# EAGLE design PCB-Neopixel Developer (EAGLE 9.5.2)
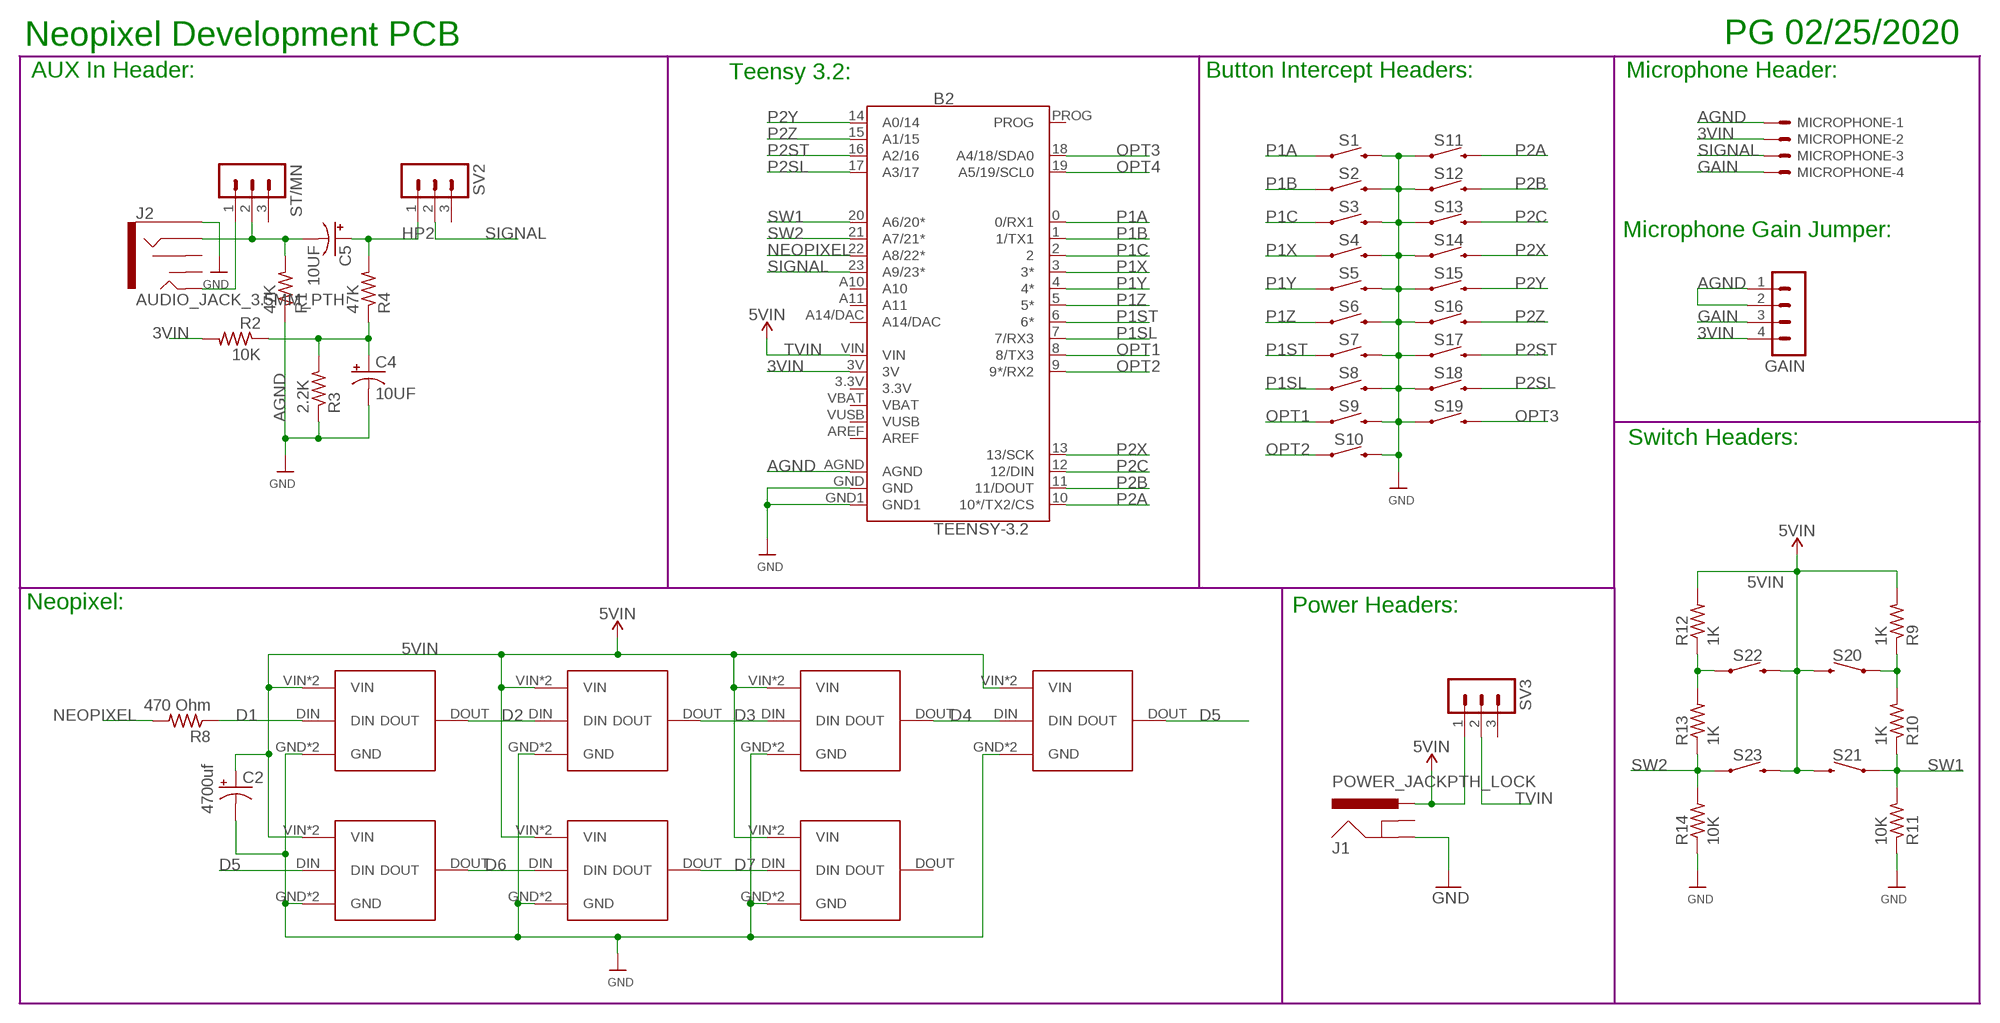
[diagram p0: schematic, sheet 1]

## Parts
B2  TEENSY-3.2  TEENSY-3.1SILK  [TEENSY-3.1]
C2  4700uf  CPOL-USE5-13  [E5-13]
C4  10UF  CPOL-USE5-8.5  [E5-8,5]
C5  10UF  CPOL-USE5-8.5  [E5-8,5]
GAIN  MA04-1  [MA04-1]
J1  POWER_JACKPTH_LOCK  [POWER_JACK_PTH_LOCK]
J2  AUDIO_JACK_3.5MM_PTH  [AUDIO-JACK]
MICROPHONE  KK-156-4  [KK-156-4]
R1  47K  R-US_R1206  [R1206]
R2  10K  R-US_R1206  [R1206]
R3  2.2K  R-US_R1206  [R1206]
R4  47K  R-US_R1206  [R1206]
R8  470 Ohm  R-US_R1206  [R1206]
R9  1K  R-US_R1206  [R1206]
R10  1K  R-US_R1206  [R1206]
R11  10K  R-US_R1206  [R1206]
R12  1K  R-US_R1206  [R1206]
R13  1K  R-US_R1206  [R1206]
R14  10K  R-US_R1206  [R1206]
S1  MOMENTARY-SWITCH-SPST-SMD-6.2MM-TALL  [TACTILE_SWITCH_SMD_6.2MM_TALL]
S2  MOMENTARY-SWITCH-SPST-SMD-6.2MM-TALL  [TACTILE_SWITCH_SMD_6.2MM_TALL]
S3  MOMENTARY-SWITCH-SPST-SMD-6.2MM-TALL  [TACTILE_SWITCH_SMD_6.2MM_TALL]
S4  MOMENTARY-SWITCH-SPST-SMD-6.2MM-TALL  [TACTILE_SWITCH_SMD_6.2MM_TALL]
S5  MOMENTARY-SWITCH-SPST-SMD-6.2MM-TALL  [TACTILE_SWITCH_SMD_6.2MM_TALL]
S6  MOMENTARY-SWITCH-SPST-SMD-6.2MM-TALL  [TACTILE_SWITCH_SMD_6.2MM_TALL]
S7  MOMENTARY-SWITCH-SPST-SMD-6.2MM-TALL  [TACTILE_SWITCH_SMD_6.2MM_TALL]
S8  MOMENTARY-SWITCH-SPST-SMD-6.2MM-TALL  [TACTILE_SWITCH_SMD_6.2MM_TALL]
S9  MOMENTARY-SWITCH-SPST-SMD-6.2MM-TALL  [TACTILE_SWITCH_SMD_6.2MM_TALL]
S10  MOMENTARY-SWITCH-SPST-SMD-6.2MM-TALL  [TACTILE_SWITCH_SMD_6.2MM_TALL]
S11  MOMENTARY-SWITCH-SPST-SMD-6.2MM-TALL  [TACTILE_SWITCH_SMD_6.2MM_TALL]
S12  MOMENTARY-SWITCH-SPST-SMD-6.2MM-TALL  [TACTILE_SWITCH_SMD_6.2MM_TALL]
S13  MOMENTARY-SWITCH-SPST-SMD-6.2MM-TALL  [TACTILE_SWITCH_SMD_6.2MM_TALL]
S14  MOMENTARY-SWITCH-SPST-SMD-6.2MM-TALL  [TACTILE_SWITCH_SMD_6.2MM_TALL]
S15  MOMENTARY-SWITCH-SPST-SMD-6.2MM-TALL  [TACTILE_SWITCH_SMD_6.2MM_TALL]
S16  MOMENTARY-SWITCH-SPST-SMD-6.2MM-TALL  [TACTILE_SWITCH_SMD_6.2MM_TALL]
S17  MOMENTARY-SWITCH-SPST-SMD-6.2MM-TALL  [TACTILE_SWITCH_SMD_6.2MM_TALL]
S18  MOMENTARY-SWITCH-SPST-SMD-6.2MM-TALL  [TACTILE_SWITCH_SMD_6.2MM_TALL]
S19  MOMENTARY-SWITCH-SPST-SMD-6.2MM-TALL  [TACTILE_SWITCH_SMD_6.2MM_TALL]
S20  MOMENTARY-SWITCH-SPST-PTH-6.0MM  [TACTILE_SWITCH_PTH_6.0MM]
S21  MOMENTARY-SWITCH-SPST-PTH-6.0MM  [TACTILE_SWITCH_PTH_6.0MM]
S22  MOMENTARY-SWITCH-SPST-PTH-6.0MM  [TACTILE_SWITCH_PTH_6.0MM]
S23  MOMENTARY-SWITCH-SPST-PTH-6.0MM  [TACTILE_SWITCH_PTH_6.0MM]
ST/MN  MA03-1  [MA03-1]
SV2  MA03-1  [MA03-1]
SV3  MA03-1  [MA03-1]
U$2  NP-2  [NP-2]
U$7  NP-2  [NP-2]
U$8  NP-3  [NP-3]
U$10  NP-3  [NP-3]
U$11  NP-3  [NP-3]
U$12  NP-3  [NP-3]
U$13  NP-3  [NP-3]

## Nets
3VIN: B2.3V GAIN.4 MICROPHONE.2 R2.2
5VIN: C2.+ J1.PWR R9.2 R12.2 S20.3 S21.3 S22.3 S23.3 SV3.1 U$2.VIN U$2.VOUT(VIN) U$7.VIN U$7.VOUT(VIN) U$8.VIN U$8.VOUT(VIN) U$10.VIN U$10.VOUT(VIN) U$11.VIN U$11.VOUT(VIN) U$12.VIN U$12.VOUT(VIN) U$13.VIN U$13.VOUT(VIN)
AGND: B2.AGND C4.- GAIN.1 GAIN.2 J2.SLEEVE MICROPHONE.1 R1.1 R3.1 ; supply symbol labelled GND
D1: R8.1 U$12.DIN
D2: U$12.DOUT U$13.DIN
D3: U$2.DIN U$13.DOUT
D4: U$2.DOUT U$11.DIN
D5: U$7.DIN U$11.DOUT
D6: U$7.DOUT U$8.DIN
D7: U$8.DOUT U$10.DIN
GAIN: GAIN.3 MICROPHONE.4
GND: B2.GND B2.GND1 C2.- J1.GND R11.1 R14.1 S1.B2 S2.B2 S3.B2 S4.B2 S5.B2 S6.B2 S7.B2 S8.B2 S9.B2 S10.B2 S11.A2 S12.A2 S13.A2 S14.A2 S15.A2 S16.A2 S17.A2 S18.A2 S19.A2 U$2.GND U$2.GND1(GND) U$7.GND U$7.GND1(GND) U$8.GND U$8.GND1(GND) U$10.GND U$10.GND1(GND) U$11.GND U$11.GND1(GND) U$12.GND U$12.GND1(GND) U$13.GND U$13.GND1(GND)
HP1: C4.+ R2.1 R3.2 R4.1
HP2: C5.+ R4.2 SV2.1
N$2: J2.TIP ST/MN.1
N$4: C5.- J2.RING R1.2 ST/MN.2
NEOPIXEL: B2.22(A8/22*) R8.2
OPT1: B2.8(8/TX3) S9.A2
OPT2: B2.9(9*/RX2) S10.A2
OPT3: B2.18(A4/18/SDA0) S19.B2
OPT4: B2.19(A5/19/SCL0)
P1A: B2.0(0/RX1) S1.A2
P1B: B2.1(1/TX1) S2.A2
P1C: B2.2 S3.A2
P1SL: B2.7(7/RX3) S8.A2
P1ST: B2.6(6*) S7.A2
P1X: B2.3(3*) S4.A2
P1Y: B2.4(4*) S5.A2
P1Z: B2.5(5*) S6.A2
P2A: B2.10(10*/TX2/CS) S11.B2
P2B: B2.11(11/DOUT) S12.B2
P2C: B2.12(12/DIN) S13.B2
P2SL: B2.17(A3/17) S18.B2
P2ST: B2.16(A2/16) S17.B2
P2X: B2.13(13/SCK) S14.B2
P2Y: B2.14(A0/14) S15.B2
P2Z: B2.15(A1/15) S16.B2
SIGNAL: B2.23(A9/23*) MICROPHONE.3 SV2.2
SW1: B2.20(A6/20*) R10.1 R11.2 S21.1
SW1A: R9.1 R10.2 S20.1
SW2: B2.21(A7/21*) R13.1 R14.2 S23.1
SW2A: R12.1 R13.2 S22.1
TVIN: B2.VIN SV3.2 ; supply symbol labelled 5VIN
Unconnected: B2.A10 B2.A11 B2.A14/DAC B2.AREF B2.PROG J1.GNDBREAK J2.RSH J2.TSH ST/MN.3 SV2.3 SV3.3 U$10.DOUT

## Notes on the sheet
- Neopixel Development PCB | PG 02/25/2020
- AUX In Header: | Teensy 3.2: | Button Intercept Headers: | Microphone Header:
- Microphone Gain Jumper:
- Switch Headers:
- Neopixel: | Power Headers:

## Power pins joined to a net without a drawn wire
3.3V: B2.3.3V
VBAT: B2.VBAT
VUSB: B2.VUSB

## Library data of the parts
B2 = SparkFun-Boards:TEENSY-3.1: Teensy 3+ Footprint Mechanical footprint with connectors for Teensy Development Board with ARM Cortex. SparkFun Products: Teensy 3.2 <https://www.sparkfun.com/products/13736> Teensy LC <https://www.sparkfun.com/products/13305>; SF_ID: DEV-12646
C2 C4 C5 = adafruit:CPOL-US: POLARIZED CAPACITOR, American symbol
GAIN = con-lstb:MA04-1: PIN HEADER; OC_FARNELL: unknown; OC_NEWARK: unknown
J1 = SparkFun-Connectors:POWER_JACK: Power Jack Connector This is the standard 5.5mm barrel jack for power. The PTH is the most common, proven, reliable, footprint. The Slot footprint only works if the mill layer is transmitted to the PCB fab house so be warned. Here are the connectors we sell at SparkFun: DC Barrel Power Jack/Connector <https://www.sparkfun.com/products/119> (PRT-00119) DC Barrel Power Jack/Connector (SMD) <https://www.sparkfun.com/products/12748> (PRT-12748) DC Barrel Jack Adapter - Breadboard Compatible <https://www.sparkfun.com/products/10811> (PRT-10811) It is used on this SparkFun product (and many, many others): SparkFun RedBoard - Programmed with Arduino <https://www.sparkfun.com/products/12757> (DEV-12757) Also, if you need a mating power supply or connector, please check these out: Wall Adapter Power Supply - 9VDC 650mA <https://www.sparkfun.com/products/298> (TOL-00298) DC Barrel Jack Adapter - Male <https://www.sparkfun.com/products/10287> (PRT-10287); PROD_ID: CONN-08197; SF_ID: PRT-00119
J2 = SparkFun-Connectors:AUDIO_JACK_3.5MM: Audio Jack 3.5mm variants of PTH and SMT stereo audio jack with bypass switches. SparkFun Products: SparkFun SparkPunk Sound Kit <[https://www.sparkfun.com/products/11177]> - PTH MP3 Trigger <https://www.sparkfun.com/products/13720> -3.5mm SMD SparkFun PicoBoard <https://www.sparkfun.com/products/11888>- 2.5mm SMD; PROD_ID: CONN-08774; SF_ID: PRT-08032
MICROPHONE = con-molex:KK-156-4: KK 156 HEADER Source: http://www.molex.com/pdm_docs/sd/026604100_sd.pdf; MF: MOLEX; OC_FARNELL: unknown; OC_NEWARK: unknown
R1-R4 R8-R14 = adafruit:R-US_: RESISTOR, American symbol
S1-S19 = SparkFun-Switches:MOMENTARY-SWITCH-SPST: Momentary Switch (Pushbutton) - SPST Normally-open (NO) SPST momentary switches (buttons, pushbuttons). Variants PTH-12MM - 12mm square, through-hole Momentary Pushbutton Switch - 12mm Square <https://www.sparkfun.com/products/9190> (COM-09190) PTH-6.0MM, PTH-6.0MM-KIT - 6.0mm square, through-hole Mini Pushbutton Switch <https://www.sparkfun.com/products/97> (COM-00097) KIT package intended for soldering kit's - only one side of pads' copper is exposed. PTH-RIGHT-ANGLE-KIT - Right-angle, through-hole Right Angle Tactile Button <https://www.sparkfun.com/products/10791> - Used on SparkFun BigTime Watch Kit <https://www.sparkfun.com/products/11734> SMD-12MM - 12mm square, surface-mount Tactile Button - SMD (12mm) <https://www.sparkfun.com/products/12993> (COM-12993) Used on SparkFun PicoBoard <https://www.sparkfun.com/products/11888> SMD-4.5MM - 4.5mm Square Trackball Switch Used on SparkFun Blackberry Trackballer Breakout <https://www.sparkfun.com/products/13169> SMD-4.6MMX2.8MM - 4.60mm x 2.80mm, surface mount Used on SparkFun SAMD21 Mini Breakout <https://www.sparkfun.com/products/13664> SMD-5.2MM, SMD-5.2-REDUNDANT - 5.2mm square, surface-mount Mini Pushbutton Switch - SMD <https://www.sparkfun.com/products/8720> (COM-08720) Used on Arduino Pro Mini <https://www.sparkfun.com/products/11114> REDUNDANT package connects both switch circuits together SMD-6.0X3.5MM - 6.0 x 3.5mm, surface mount Momentary Reset Switch SMD <https://www.sparkfun.com/products/8229> (COM-08229) SMD-6.2MM-TALL - 6.2mm square, surface mount Tactile Button - SMD (6mm) <https://www.sparkfun.com/products/12992> Used on SparkFun Digital Sandbox <https://www.sparkfun.com/products/12651> SMD-RIGHT-ANGLE - Right-angle, surface mount Used on SparkFun Block for Intel® Edison - Arduino <https://www.sparkfun.com/products/13036>; PROD_ID: SWCH-11966; SF_SKU: COM-12992
S20-S23 = SparkFun-Switches:MOMENTARY-SWITCH-SPST: Momentary Switch (Pushbutton) - SPST Normally-open (NO) SPST momentary switches (buttons, pushbuttons). Variants PTH-12MM - 12mm square, through-hole Momentary Pushbutton Switch - 12mm Square <https://www.sparkfun.com/products/9190> (COM-09190) PTH-6.0MM, PTH-6.0MM-KIT - 6.0mm square, through-hole Mini Pushbutton Switch <https://www.sparkfun.com/products/97> (COM-00097) KIT package intended for soldering kit's - only one side of pads' copper is exposed. PTH-RIGHT-ANGLE-KIT - Right-angle, through-hole Right Angle Tactile Button <https://www.sparkfun.com/products/10791> - Used on SparkFun BigTime Watch Kit <https://www.sparkfun.com/products/11734> SMD-12MM - 12mm square, surface-mount Tactile Button - SMD (12mm) <https://www.sparkfun.com/products/12993> (COM-12993) Used on SparkFun PicoBoard <https://www.sparkfun.com/products/11888> SMD-4.5MM - 4.5mm Square Trackball Switch Used on SparkFun Blackberry Trackballer Breakout <https://www.sparkfun.com/products/13169> SMD-4.6MMX2.8MM - 4.60mm x 2.80mm, surface mount Used on SparkFun SAMD21 Mini Breakout <https://www.sparkfun.com/products/13664> SMD-5.2MM, SMD-5.2-REDUNDANT - 5.2mm square, surface-mount Mini Pushbutton Switch - SMD <https://www.sparkfun.com/products/8720> (COM-08720) Used on Arduino Pro Mini <https://www.sparkfun.com/products/11114> REDUNDANT package connects both switch circuits together SMD-6.0X3.5MM - 6.0 x 3.5mm, surface mount Momentary Reset Switch SMD <https://www.sparkfun.com/products/8229> (COM-08229) SMD-6.2MM-TALL - 6.2mm square, surface mount Tactile Button - SMD (6mm) <https://www.sparkfun.com/products/12992> Used on SparkFun Digital Sandbox <https://www.sparkfun.com/products/12651> SMD-RIGHT-ANGLE - Right-angle, surface mount Used on SparkFun Block for Intel® Edison - Arduino <https://www.sparkfun.com/products/13036>; PROD_ID: SWCH-08441; SF_SKU: COM-00097
ST/MN SV2 SV3 = con-lstb:MA03-1: PIN HEADER; OC_FARNELL: unknown; OC_NEWARK: unknown
U$2 U$7 = Neopixel:NP-2
U$8 U$10-U$13 = Neopixel:NP-3

## Board
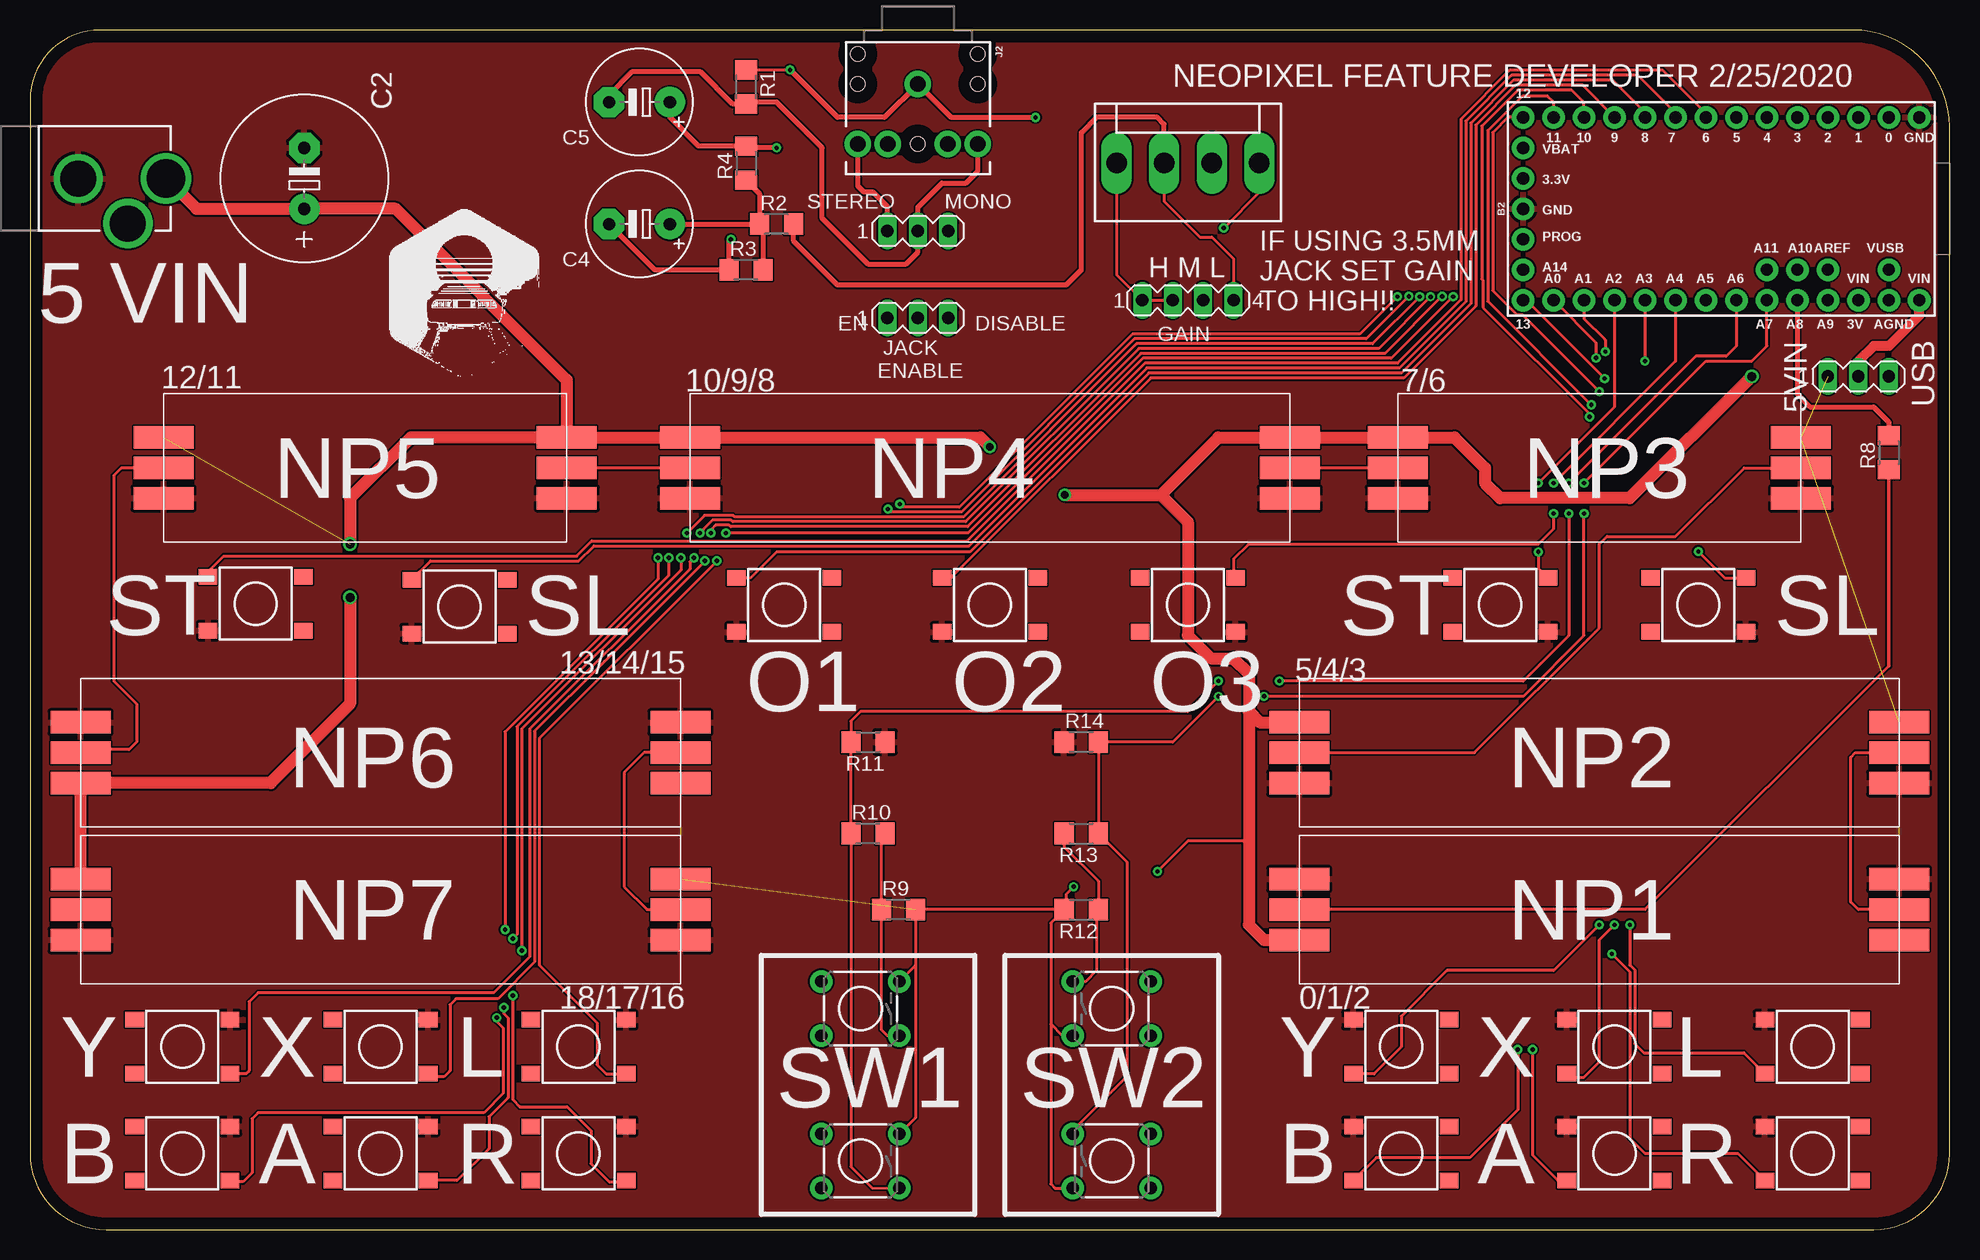
[diagram p1: board, top side]
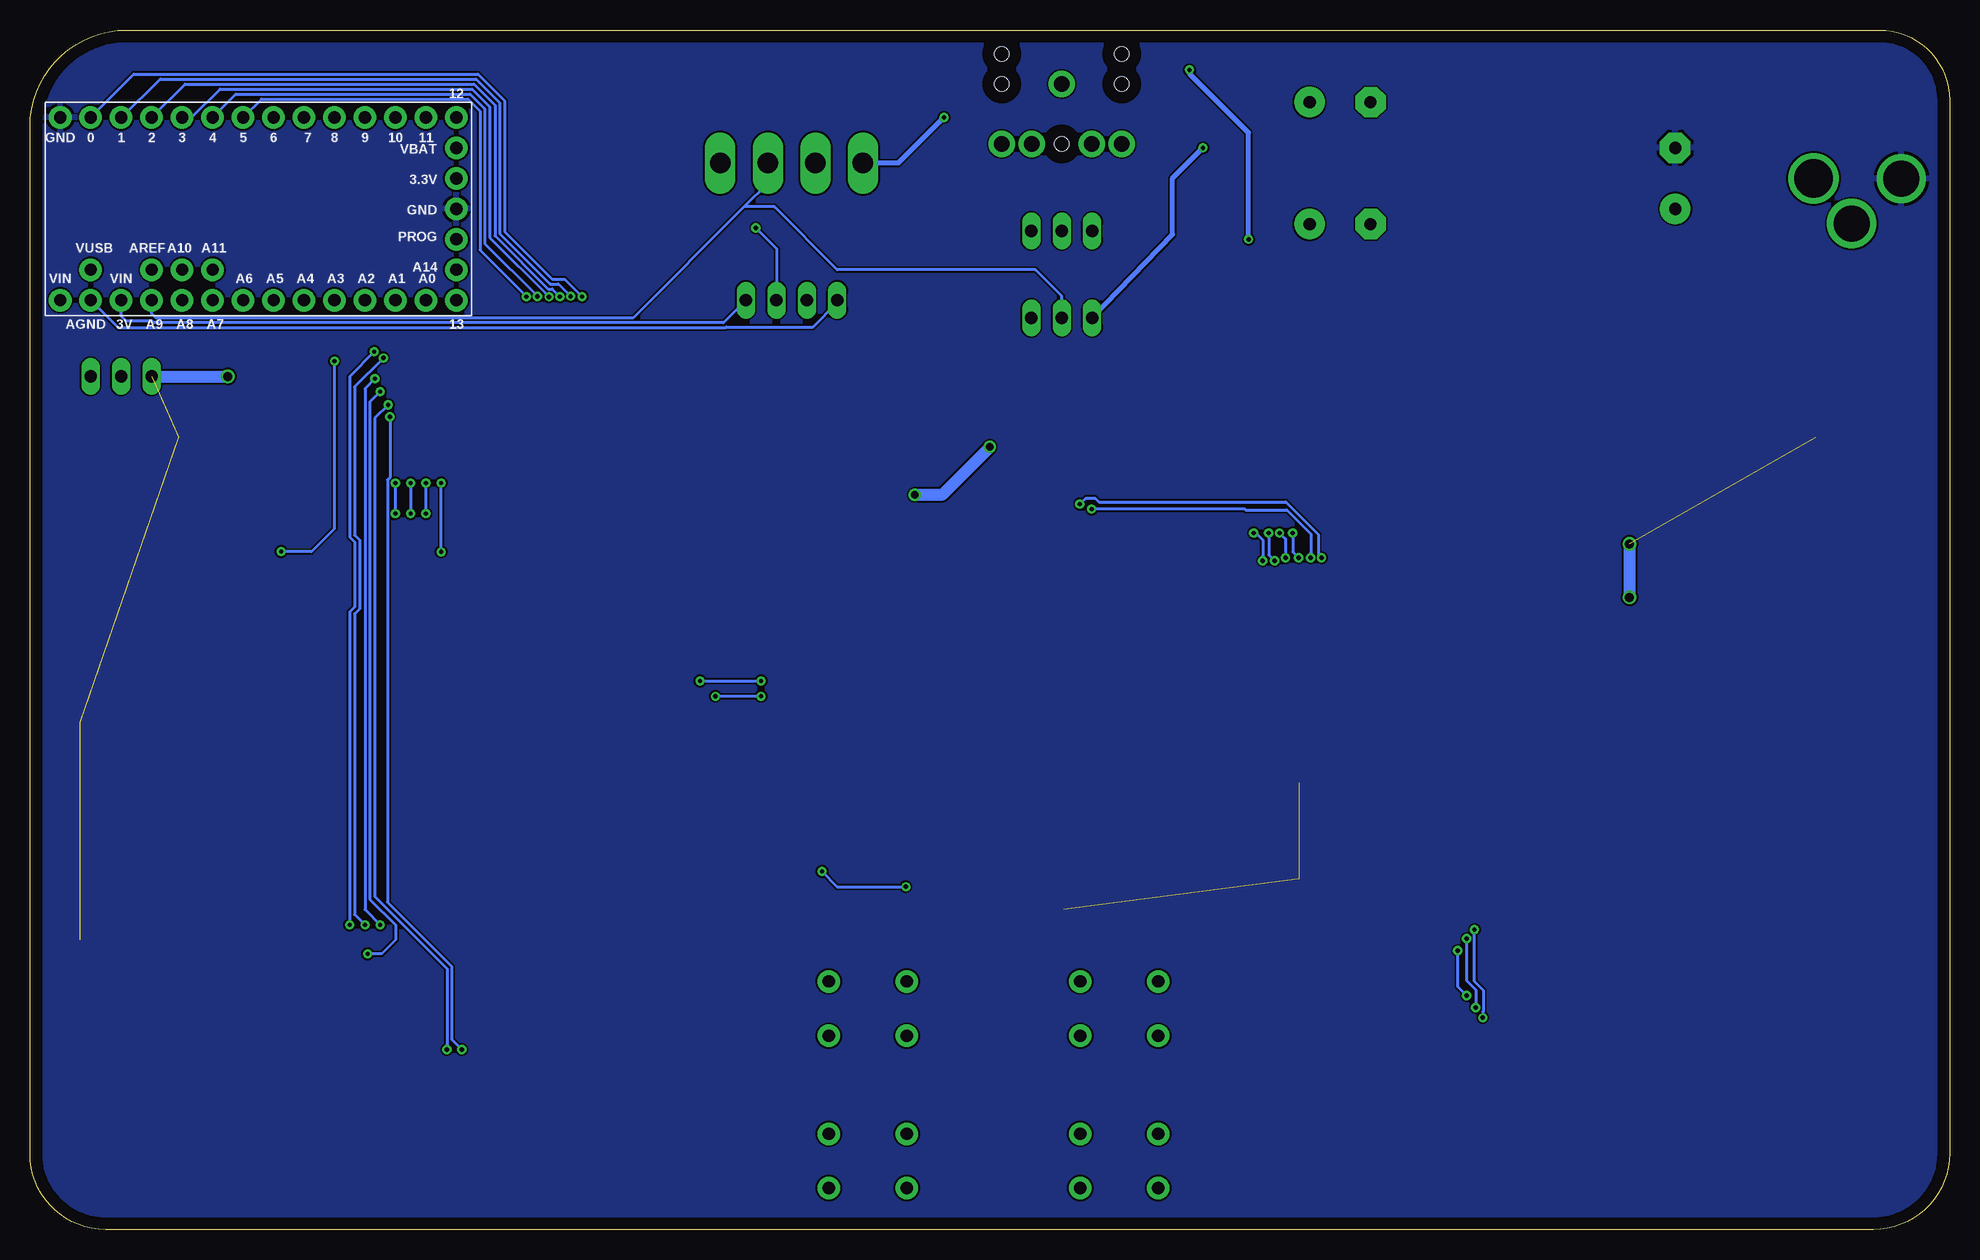
[diagram p2: board, bottom side, seen from below]

Size 160 x 100 mm. Coordinates in mm from the lower left corner, seen from the top.
Outline: 151.93,100 5.85,100 arc90 0,94.15 0,6.35 arc90 6.35,0 153.69,0 arc90 160,6.31 160,91.93 arc90 151.93,100
Copper layers (1*16): Top 0.035mm / dielectric 1.5mm / Bottom 0.035mm
Design rules "default": minimum track width 6mil, minimum drill 0.35mm, track to track 6mil, track to pad 6mil, pad to pad 6mil, via to via 6mil, smd to smd 6mil, copper to edge 40mil, drill to drill 6mil, minimum pad ring 10mil, minimum via ring 8mil, stop-mask expansion 4mil, vias tented up to drill 0.5mm, thermal gap 10mil

### Footprints (pad centres in the part's own frame; a part is rotated, then mirrored left to right if it is on the bottom)
TEENSY-3.1 = drill 1.016 pad 1.88: 0 7.62,-13.97; 1 7.62,-11.43; 2 7.62,-8.89; 3 7.62,-6.35; 3.3V 2.54,16.51; 3V -7.62,-11.43; 4 7.62,-3.81; 5 7.62,-1.27; 6 7.62,1.27; 7 7.62,3.81; 8 7.62,6.35; 9 7.62,8.89; 10 7.62,11.43; 11 7.62,13.97; 12 7.62,16.51; 13 -7.62,16.51; 14 -7.62,13.97; 15 -7.62,11.43; 16 -7.62,8.89; 17 -7.62,6.35; 18 -7.62,3.81; 19 -7.62,1.27; 20 -7.62,-1.27; 21 -7.62,-3.81; 22 -7.62,-6.35; 23 -7.62,-8.89; A10 -5.08,-6.35; A11 -5.08,-3.81; A14/DAC -5.08,16.51; AGND -7.62,-13.97; AREF -5.08,-8.89; GND 0,16.51; GND1 7.62,-16.51; PROG -2.54,16.51; VBAT 5.08,16.51; VIN -7.62,-16.51; VUSB -5.08,-13.97
E5-13 = drill 1.016 pad 2.54: + -2.54,0 | drill 1.016 pad 2.54 octagon: - 2.54,0
E5-8,5 = drill 1.016 pad 2.54: + -2.54,0 | drill 1.016 pad 2.54 octagon: - 2.54,0
MA04-1 = drill 1.016 long: 1 -3.81,0; 2 -1.27,0; 3 1.27,0; 4 3.81,0
POWER_JACK_PTH_LOCK = drill 2.997 pad 4.115: GND 0.025,6.557; GNDBREAK 3.762,10.7 | drill 3.2 pad 4.115: PWR 0,13.878
AUDIO-JACK = drill 1.3 pad 2.184: RING 5,5; RSH 5,2.5; SLEEVE 0,0; TIP 5,-5; TSH 5,-2.5 | hole 1.2: 0,5; -2.5,5; -2.5,-5; 0,-5; 5,0
KK-156-4 = drill 1.7 pad 2.184 long: 1 -5.94,0; 2 -1.98,0; 3 1.98,0; 4 5.94,0
R1206 = smd 1.6 x 1.803: 1 -1.422,0; 2 1.422,0
TACTILE_SWITCH_SMD_6.2MM_TALL = smd 1.55 x 1.3: A1 -3.975,-2.25; A2 3.975,-2.25; B1 -3.975,2.25; B2 3.975,2.25
TACTILE_SWITCH_PTH_6.0MM = drill 1.016 pad 1.88: 1 -3.251,2.261; 2 3.251,2.261; 3 -3.251,-2.261; 4 3.251,-2.261
MA03-1 = drill 1.016 long: 1 -2.54,0; 2 0,0; 3 2.54,0
NP-2 = smd 5 x 1.85: DIN 16.8,0; DOUT -16.8,0; GND -16.8,-2.54; GND1 16.8,-2.54; VIN -16.8,2.54; VOUT 16.8,2.54
NP-3 = smd 5 x 1.85: DIN 25,0; DOUT -25,0; GND -25,-2.54; GND1 25,-2.54; VIN -25,2.54; VOUT 25,2.54

### Placement (x,y rotation side)
B2  140.97,85.09 90 top
C2  22.86,87.63 90 top
C4  50.8,83.82 180 top
C5  50.8,93.98 180 top
GAIN  96.52,77.47 0 top
J1  -2.54,87.63 270 top
J2  74,95.5 270 top
MICROPHONE  96.52,88.9 0 top
R1  59.69,95.25 270 top
R2  62.23,83.82 0 top
R3  59.69,80.01 0 top
R4  59.69,88.9 90 top
R8  154.94,64.77 90 top
R9  72.39,26.67 0 top
R10  69.85,33.02 0 top
R11  69.85,40.64 180 top
R12  87.63,26.67 180 top
R13  87.63,33.02 180 top
R14  87.63,40.64 0 top
S1  12.7,6.35 0 top
S2  29.21,6.35 0 top
S3  45.72,6.35 0 top
S4  12.7,15.24 0 top
S5  29.21,15.24 0 top
S6  45.72,15.24 0 top
S7  18.82,52.18 180 top
S8  35.8,51.93 180 top
S9  62.87,52.07 180 top
S10  80.01,52.07 180 top
S11  114.3,6.35 180 top
S12  132.08,6.35 180 top
S13  148.59,6.35 180 top
S14  114.3,15.24 180 top
S15  132.08,15.24 180 top
S16  148.59,15.24 180 top
S17  122.56,52.07 0 top
S18  139.06,52.07 0 top
S19  96.52,52.07 0 top
S20  69.22,18.41 180 top
S21  69.22,5.71 180 top
S22  90.17,18.41 0 top
S23  90.17,5.71 0 top
ST/MN  74,83.25 0 top
SV2  74,76 0 top
SV3  152.4,71.12 0 top
U$2  130.81,63.5 0 top
U$7  27.94,63.5 0 top
U$8  29.21,39.75 180 top
U$10  29.21,26.67 0 top
U$11  80.01,63.5 0 top
U$12  130.81,26.67 180 top
U$13  130.81,39.75 0 top

### Tracks (layer width: path | path; a pad name or v marks a point on that pad's centre or on a via)
3VIN
  Top 0.254: MICROPHONE.2 94.54,85.71 97.5,82.75 98.5,82.75 100.33,80.92 GAIN.4
  Top 0.406: MICROPHONE.2 94.54,92.15 93.98,92.71 88.9,92.71 87.63,91.44 87.63,80.01 86.36,78.74 67.31,78.74 63.65,82.4 R2.2
  Bottom 0.254: GAIN.4 102.21,75.59 149.67,75.59 149.82,75.75 152,75.75 152.4,76.15 B2.3V
5VIN  (via drill 0.35, 0.6, 0.75)  (6 unrouted)
  Top 0.254: 101.6,32.38 96.52,32.38 v93.98,29.84 | v87,28.57 86.36,27.94 86.36,26.82 R12.2 | R12.2 R9.2 73.81,22.02 | 73.81,22.02 S20.3 | 73.81,22.02 73.81,9.32 S21.3 | R12.2 85.09,25.55 85.09,17.14 | 85.09,17.14 85.09,3.81 85.45,3.45 S23.3 | S22.3 86.08,16.15 85.09,17.14
  Top 1.016: J1.PWR 13.88,85.09 C2.+ 30.48,85.09 44.74,70.83 U$7.VOUT | U$7.VOUT U$11.VIN 79.21,66.04 v80,65.25 | v86.25,61.25 94.27,61.25 | 94.27,61.25 99.06,66.04 U$11.VOUT U$2.VIN 118.75,66.04 121.28,63.5 121.28,62.23 122.56,60.96 133.35,60.96 v143.51,71.12 | 94.27,61.25 96.52,59 96.52,49.53 98.42,47.62 100.33,47.62 101.6,46.35 101.6,43.18 | U$13.VIN 102.49,42.29 101.6,43.18 | 101.6,43.18 101.6,32.38 101.6,25.4 102.87,24.13 U$12.VOUT | U$7.VOUT 31.75,66.04 26.67,60.96 v26.67,57.15 | v26.67,52.7 26.67,43.81 20.07,37.21 U$8.VOUT U$10.VIN
  Bottom 0.254: v93.98,29.84 92.71,28.57 v87,28.57
  Bottom 1.016: v80,65.25 84,61.25 v86.25,61.25 | SV3.1 v143.51,71.12 | v26.67,57.15 v26.67,52.7
AGND  (via drill 0.35)
  Top 0.254: MICROPHONE.1 90.58,79.6 GAIN.1 GAIN.2 | R1.1 v63.35,96.67
  Top 0.406: C4.- 52.07,80.01 R3.1 58.27,82.4 v58.42,82.55 | v63.35,96.67 67.31,92.71 71.21,92.71 J2.SLEEVE 76.79,92.71 v83.82,92.71
  Bottom 0.254: B2.AGND 152.66,75.19 102.04,75.19 101.97,75.25 94.75,75.25 92.71,77.29 GAIN.1
  Bottom 0.406: v83.82,92.71 87.63,88.9 MICROPHONE.1 | v58.42,82.55 58.42,91.44 63.35,96.37 v63.35,96.67
D1
  Top 0.254: U$12.DIN 134.62,26.67 154.94,46.99
  Top 0.305: R8.1 154.94,46.99
D2
  Top 0.254: U$12.DOUT 152.4,26.67 151.76,27.3 151.76,39.37 152.15,39.75 U$13.DIN
D3
  Top 0.254: U$13.DOUT 120.4,39.75 130.81,50.16 130.81,57.15 131.44,57.78 137.16,57.78 142.88,63.5 U$2.DIN
D4
  Top 0.254: U$2.DOUT U$11.DIN
D5
  Top 0.254: U$11.DOUT U$7.DIN
D6
  Top 0.254: U$8.DIN 4.46,40.01 8.26,40.01 8.89,40.64 8.89,43.81 6.99,45.72 6.99,62.87 7.62,63.5 U$7.DOUT
D7
  Top 0.254: U$8.DOUT 51.18,39.75 49.53,38.1 49.53,28.57 51.44,26.67 U$10.DIN
GAIN  (via drill 0.35)
  Top 0.254: MICROPHONE.4 102.46,86.46 v99.5,83.5
  Bottom 0.254: GAIN.3 97.75,77.51 97.75,81.75 v99.5,83.5
GND
  pour Top: 0,0 160.02,0 160.02,100.33 0,100.33
  pour Bottom: 0,0 160.02,0 160.02,100.33 0,100.33
HP1
  Top 0.406: C4.+ R2.1 | R4.1 60.81,86.36 R2.1 | R2.1 61.11,83.52 R3.2
HP2  (via drill 0.35)
  Top 0.406: v62.23,90.17 59.84,90.17 R4.2 55.73,90.32 53.34,92.71 C5.+
  Bottom 0.406: SV2.1 64.77,82.94 64.77,87.63 v62.23,90.17
N$2
  Top 0.406: ST/MN.1 71.46,85.29 70.25,86.5 69.5,86.5 69,87 J2.TIP
N$4
  Top 0.406: J2.RING 79,88.25 78,87.25 76,87.25 74,85.25 ST/MN.2 74,81.5 73,80.5 69.85,80.5 66.04,84.31 66.04,90.17 62.23,93.98 59.84,93.98 R1.2 58.57,93.83 55.88,96.52 50.16,96.52 48.26,94.61 C5.-
NEOPIXEL
  Top 0.406: R8.2 154.94,67.31 153.67,68.58 148.37,68.58 147.32,69.63 B2.22
OPT1
  Top 0.254: B2.8 134.62,93.13 131.94,95.81 123.66,95.81 120.09,92.24 120.09,77.17 114.33,71.41 93.26,71.41 78.35,56.5 62.23,56.5 60.05,54.32 S9.A2
OPT2
  Top 0.254: B2.9 132.08,92.75 129.42,95.41 123.83,95.41 120.5,92.08 120.5,77 114.5,71 93.43,71 76.75,54.32 S10.A2
OPT3  (via drill 0.35)
  Top 0.254: B2.18 137.16,72.39 v127,62.23 | v127,59.69 127,58.42 125.73,57.15 101.6,57.15 100.33,55.88 100.33,54.48 S19.B2
  Bottom 0.254: v127,59.69 v127,62.23
P1A  (via drill 0.35)
  Top 0.254: v113.97,77.78 110.85,74.66 91.91,74.66 77.48,60.22 72.5,60.22 v72.5,60.48 | v38.91,17.66 38.91,17.34 39.44,16.81 39.44,11.34 37.84,9.75 19,9.75 18.5,9.25 18.5,4.75 17.75,4 16.77,4 S1.A2 | v52.34,56 52.34,54.24 39.59,41.49 v39.59,25
  Bottom 0.254: B2.0 151.34,96.31 122.66,96.31 120.44,94.09 120.44,83.19 116.48,79.23 115.42,79.23 v113.97,77.78 | v72.5,60.48 72,60.98 71.23,60.98 70.91,60.66 55.33,60.66 52.59,57.92 52.59,56.25 v52.34,56 | v38.91,17.66 38.91,18.16 38.84,18.23 38.84,19.92 39.59,20.67 v39.59,25
P1B  (via drill 0.35)
  Top 0.254: v114.92,77.8 111.38,74.25 92.08,74.25 77.65,59.82 71.76,59.82 v71.5,60.07 | S2.A2 35.6,4.1 38.25,6.75 38.25,9.41 39.84,11 39.84,17.66 39.5,18 v39.5,18.5 | v53.25,56 53.25,54.58 40.59,41.92 40.59,24.59 v40.25,24.25
  Bottom 0.254: B2.1 152.33,92.71 149.14,95.91 122.83,95.91 120.84,93.92 120.84,83.02 116.65,78.82 115.95,78.82 v114.92,77.8 | v53.25,56 53.25,58 55.25,60 58.69,60 58.76,60.07 v71.5,60.07 | v39.5,18.5 39.5,20 40.25,20.75 v40.25,24.25
P1C  (via drill 0.35)
  Top 0.254: v115.83,77.78 111.9,73.84 92.25,73.84 77.82,59.41 58.73,59.41 58.61,59.53 56.22,59.53 v54.75,58.06 | v40.25,19.5 40.25,10.83 40.83,10.25 44.75,10.25 46.75,8.25 46.75,5.5 48.25,4 49.59,4 S3.A2 | v54.25,56 54.25,55 41,41.75 v41,23.25
  Bottom 0.254: B2.2 147.07,95.5 123,95.5 121.25,93.75 121.25,82.84 116.83,78.42 116.47,78.42 v115.83,77.78 | v54.75,58.06 54.75,56.5 v54.25,56 | v40.25,19.5 41,20.25 v41,23.25
P1SL
  Top 0.254: B2.7 137.16,93.09 134.03,96.22 123.5,96.22 119.69,92.41 119.69,77.34 114.16,71.81 93.09,71.81 78.28,57 47,57 45.74,55.74 33.39,55.74 S8.A2
P1ST
  Top 0.254: B2.6 139.7,93.05 136.12,96.63 123.33,96.63 119.28,92.58 119.28,77.5 114,72.22 92.92,72.22 78.11,57.41 46.83,57.41 45.57,56.15 16.14,56.15 14.84,54.84 S7.A2
P1X  (via drill 0.35)
  Top 0.254: v116.74,77.76 112.42,73.44 92.42,73.44 77.98,59 58.56,59 58.44,59.13 56.88,59.13 56.09,58.34 56.09,58.31 v55.84,58.06 | v55.34,56 55,55.66 55,55.08 41.66,41.73 41.66,22.75 38.66,19.75 19,19.75 18.25,19 18.25,13.25 17.99,12.99 S4.A2
  Bottom 0.254: B2.3 146.5,92.71 144.15,95.06 123.16,95.06 121.69,93.59 121.69,82.7 v116.74,77.76 | v55.84,58.06 55.34,57.56 v55.34,56
P1Y  (via drill 0.35)
  Top 0.254: v117.71,77.79 112.95,73.03 92.59,73.03 78.15,58.6 58.4,58.6 58.27,58.72 57.15,58.72 56.75,58.32 v56.75,58.06 | S5.A2 33.42,12.75 34.5,12.75 35,13.25 35,18.75 35.5,19.25 39,19.25 42.06,22.31 42.06,41.56 47.88,47.38 v56.25,55.75
  Bottom 0.254: B2.4 142.83,94.66 123.33,94.66 122.09,93.42 122.09,82.18 v117.71,77.79 | v56.75,58.06 56.75,56.25 v56.25,55.75
P1Z  (via drill 0.35)
  Top 0.254: v118.62,77.78 113.47,72.63 92.75,72.63 78.19,58.06 v58,58.06 | v57.25,55.75 42.47,40.97 42.47,22.03 47.25,17.25 47.25,13.75 48.01,12.99 S6.A2
  Bottom 0.254: B2.5 140.7,94.25 123.5,94.25 122.5,93.25 122.5,81.65 v118.62,77.78 | v58,58.06 57.81,58.06 57.25,57.5 v57.25,55.75
P2A  (via drill 0.35)
  Top 0.254: B2.10 129.5,92.75 129.5,94 128.5,95 124,95 121,92 121,79.25 121.11,79.14 121.11,76.86 130,67.97 v130,67.75 | v124,15 124,10 120,6 112.22,6 S11.B2
  Bottom 0.254: v130,67.75 130,62.7 130.2,62.5 130.2,27.27 124.84,21.92 124.84,15.84 v124,15
P2B  (via drill 0.35)
  Top 0.254: B2.11 127,93.98 126.48,94.5 124.41,94.5 121.51,91.61 121.51,77.39 v130.15,68.75 | v125.25,15 125.25,6.2 127.34,4.1 S12.B2
  Bottom 0.254: v125.25,15 125.25,21.75 131.27,27.77 131.27,67.64 v130.15,68.75
P2C  (via drill 0.35)
  Top 0.254: B2.12 123.19,92.71 121.92,91.44 121.92,78.29 123.95,76.25 124.41,76.25 v130.81,69.85 | v131.85,22.99 133.35,21.49 133.35,7.62 134.62,6.35 142.37,6.35 S13.B2
  Bottom 0.254: v131.85,22.99 130.68,22.99 129.54,24.13 129.54,25.4 131.67,27.53 131.67,68.99 v130.81,69.85
P2SL  (via drill 0.35)
  Top 0.254: B2.17 v134.62,72.39 | v139.06,56.52 141.26,54.32 S18.B2
  Bottom 0.254: v134.62,72.39 134.62,58.42 136.53,56.52 v139.06,56.52
P2ST  (via drill 0.35)
  Top 0.254: B2.16 132.08,68.58 v125.73,62.23 | S17.B2 125.73,55.12 v125.73,56.49
  Bottom 0.254: v125.73,56.49 v125.73,62.23
P2X  (via drill 0.35)
  Top 0.254: v131.25,70.93 124.71,77.47 B2.13 | v130.81,25.4 127,21.59 118.11,21.59 114.3,17.78 114.3,15.24 112.03,12.97 110.34,12.97 S14.B2
  Bottom 0.254: v130.81,25.4 132.08,26.67 132.08,70.1 v131.25,70.93
P2Y  (via drill 0.35)
  Top 0.254: B2.14 130.54,73.93 v130.54,72.66 | S15.B2 128.4,12.7 129.54,12.7 130.81,13.97 130.81,24.13 v132.08,25.4
  Bottom 0.254: v130.54,72.66 132.94,70.26 132.94,57.89 132.54,57.49 132.54,51.73 132.94,51.33 132.94,26.26 v132.08,25.4
P2Z  (via drill 0.35)
  Top 0.254: B2.15 129.54,75.95 131.31,74.18 v131.31,73.18 | v133.35,25.4 133.35,22.06 133.76,21.65 133.76,15.49 134.5,14.75 142.85,14.75 S16.B2
  Bottom 0.254: v131.31,73.18 v131.3,73.17 133.35,71.12 133.35,57.73 132.94,57.32 132.94,51.9 133.35,51.49 v133.35,25.4
SIGNAL
  Bottom 0.254: MICROPHONE.3 98.5,87.25 100.5,85.25 | B2.23 149.86,76.36 149.5,76 109.75,76 100.5,85.25 | 100.5,85.25 97.95,85.25 92.71,80.01 76.2,80.01 74,77.81 SV2.2
SW1  (via drill 0.35)
  Top 0.254: B2.20 142.24,73.66 141.38,72.8 138.84,72.8 v128.27,62.23 | v128.27,59.69 128.27,49.53 124.46,45.72 v104.14,45.72 | v99.06,45.72 96.52,43.18 69.22,43.18 68.43,42.39 R11.2 R10.1 68.43,5.23 70.19,3.46 S21.1
  Bottom 0.254: v128.27,62.23 v128.27,59.69 | v104.14,45.72 v99.06,45.72
SW1A
  Top 0.254: S20.1 71.47,16.16 70.97,16.66 R9.1 70.97,32.72 R10.2
SW2  (via drill 0.35)
  Top 0.254: v129.54,59.69 129.54,49.53 124.46,44.45 v102.87,44.45 | v99.06,44.45 95.25,40.64 R14.2 R13.1 91.44,30.63 91.44,12.76 86.64,7.96 S23.1 | v129.54,62.23 139.7,72.39 143.51,72.39 144.78,73.66 B2.21
  Bottom 0.254: v129.54,59.69 v129.54,62.23 | v99.06,44.45 v102.87,44.45
SW2A
  Top 0.254: R13.2 86.21,31.9 89.05,29.06 R12.1 88.9,26.52 88.9,21.59 87.97,20.66 S22.1
TVIN
  Top 0.813: B2.VIN 157.48,76.2 154.94,73.66 153.67,73.66 152.4,72.39 SV3.2

### Text on the board
tPlace: NEOPIXEL FEATURE DEVELOPER 2/25/2020 | STEREO | MONO | H M L | IF USING 3.5MM / JACK SET GAIN / TO HIGH!! | EN | DISABLE | 5VIN | JACK / ENABLE | 12/11 | 10/9/8 | 7/6 | USB | 13/14/15 | 5/4/3 | 18/17/16 | 0/1/2
tNames: 5 VIN | NP5 | NP4 | NP3 | ST | SL | ST | SL | O1 | O2 | O3 | NP6 | NP2 | NP7 | NP1 | Y | X | L | Y | X | L | SW1 | SW2 | B | A | R | B | A | R